# Altium schematic sheet MultiSensor.SchDoc
size 420 x 297 mm; SheetNumber: 1; SheetTotal: 1
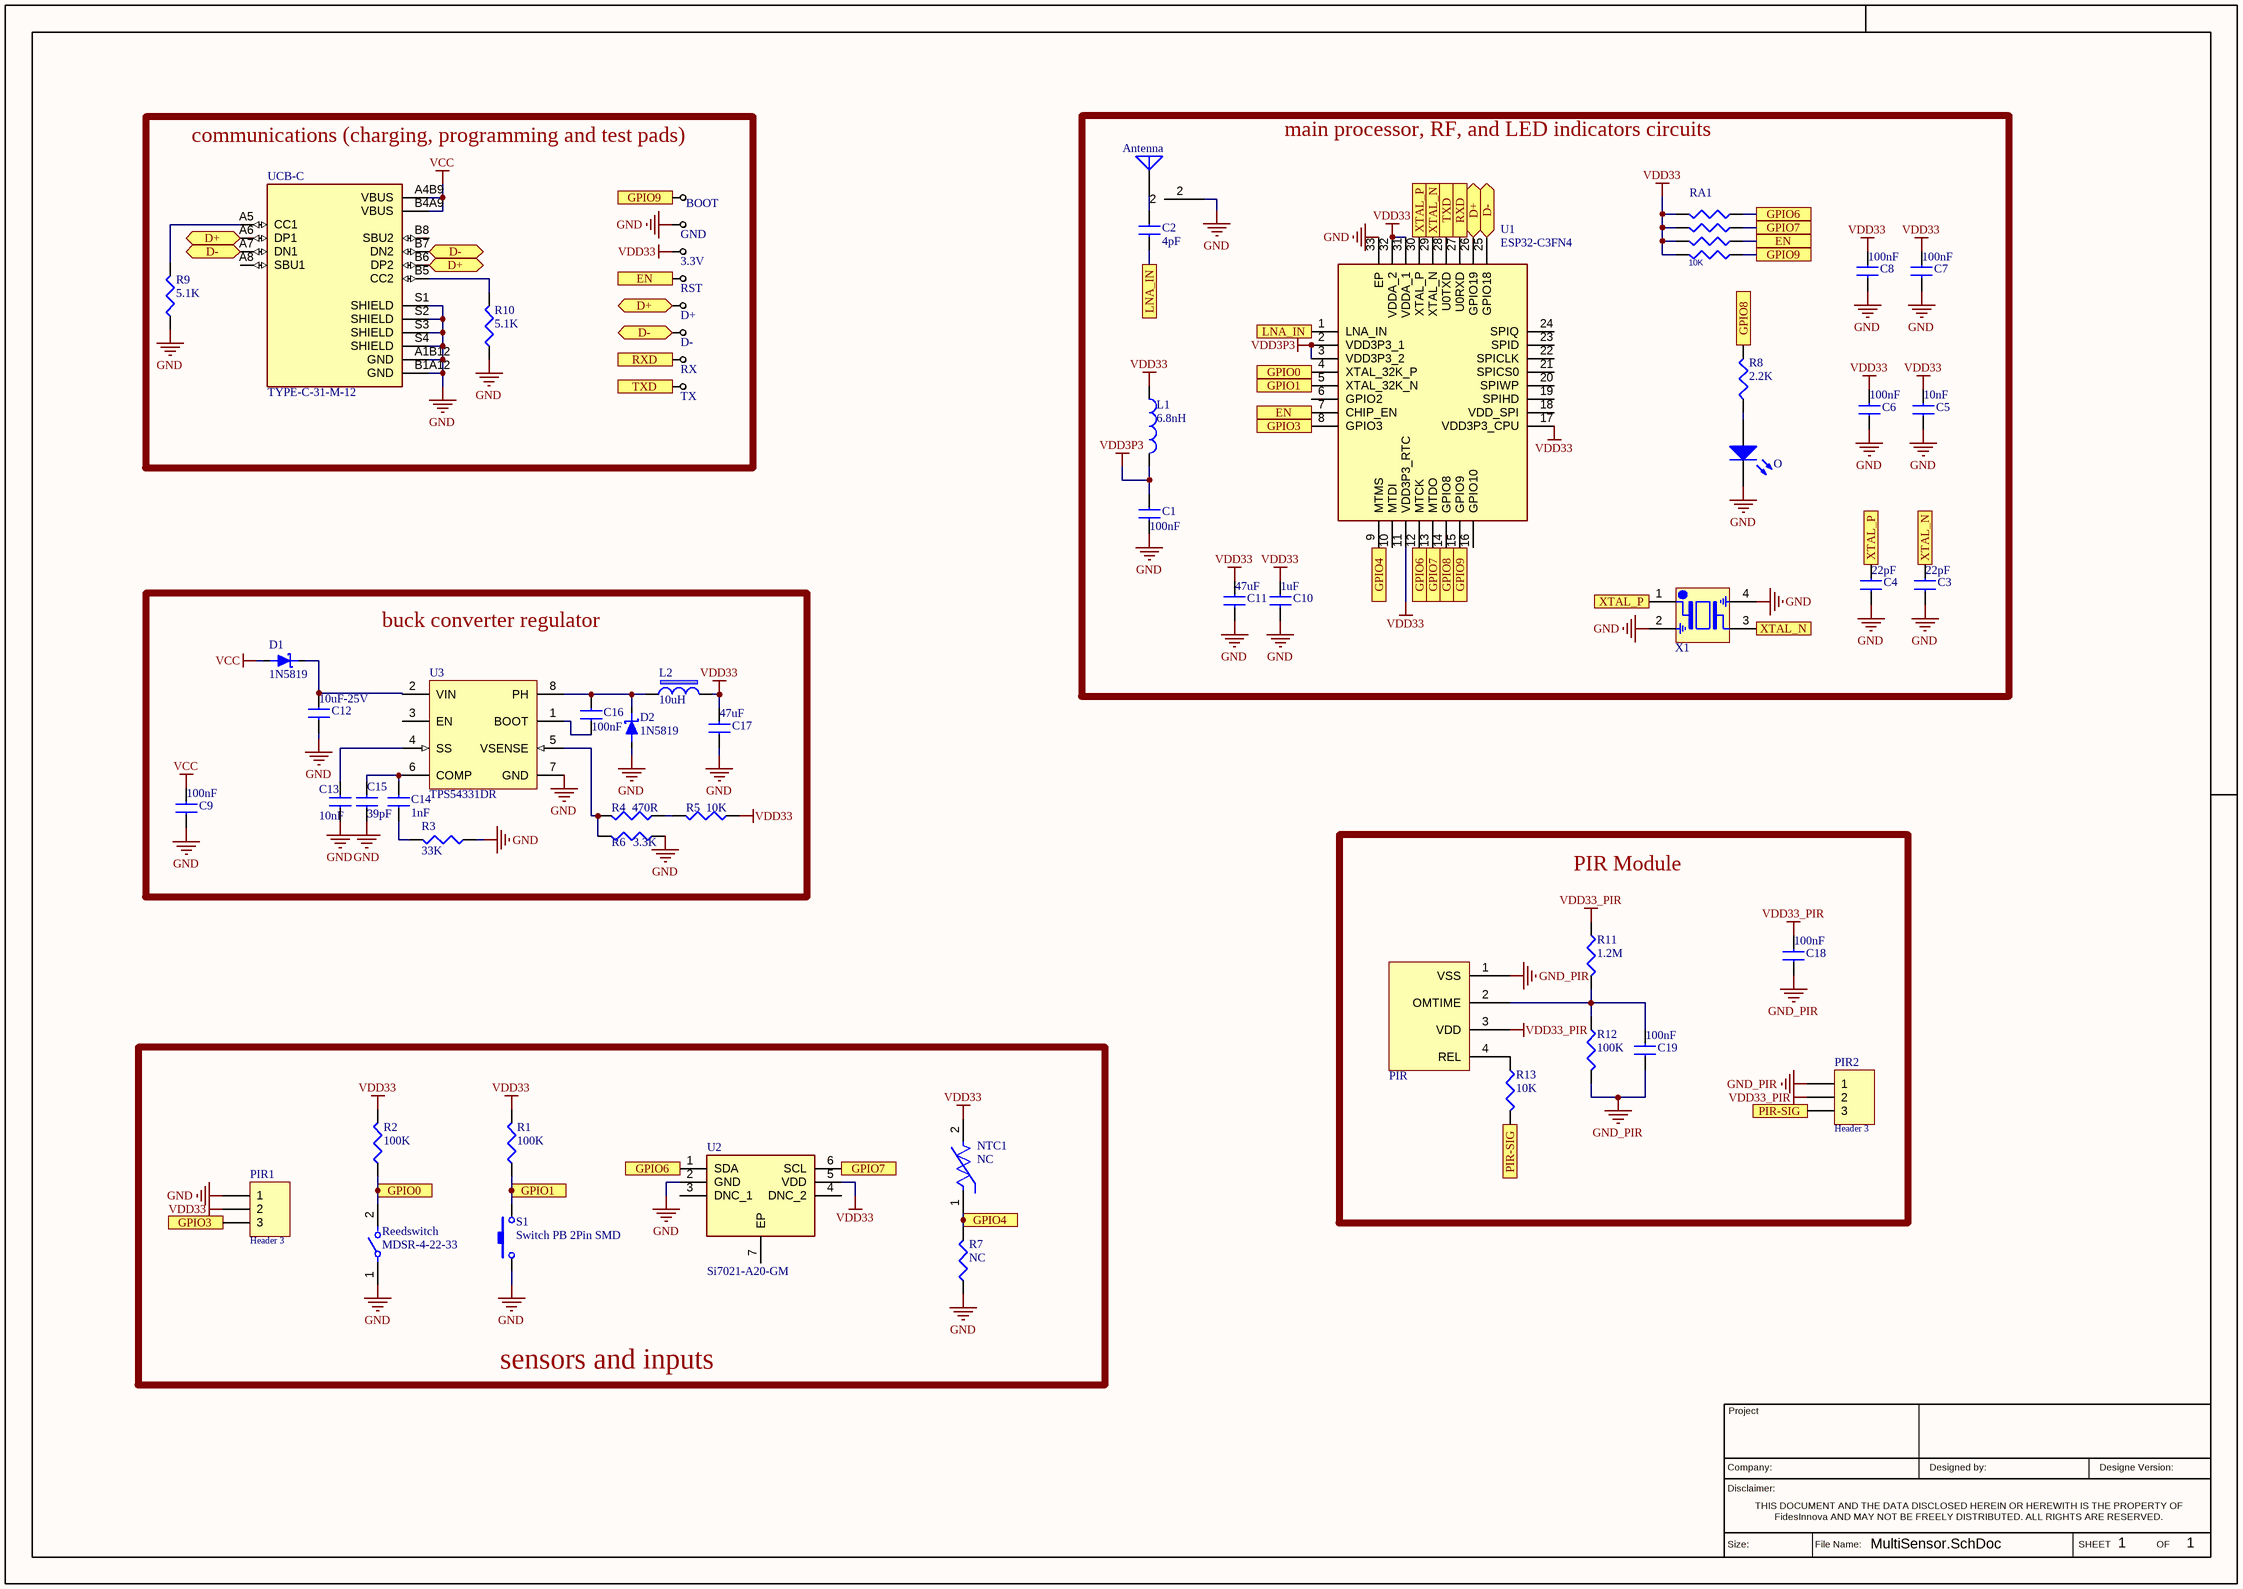
[diagram p0: MultiSensor.SchDoc]

## Parts
3.3V  Test Point  [Test Point SMD]  (value not drawn)  (no BOM)
Antenna  Antenna  [Antenna_IIFA_2.4GHz_ESP]  (value not drawn)  (no BOM)
BOOT  Test Point  [Test Point SMD]  (value not drawn)  (no BOM)
C1  100nF  [0603_C]
C2  4pF  [0603_C]
C3  22pF  [0603_C]
C4  22pF  [0603_C]
C5  10nF  [0603_C]
C6  100nF  [0603_C]
C7  100nF  [0603_C]
C8  100nF  [0603_C]
C9  100nF  [0603_C]
C10  1uF  [0603_C]
C11  47uF  [1206_C]
C12  10uF-25V  [1206_C]
C13  10nF  [0603_C]
C14  1nF  [0603_C]
C15  39pF  [0603_C]
C16  100nF  [0603_C]
C17  47uF  [1206_C]
C18  100nF  [0603_C]
C19  100nF  [0603_C]
D1  1N5819  [DO-214AC]
D2  1N5819  [DO-214AC]
D+  Test Point  [Test Point SMD]  (value not drawn)  (no BOM)
D-  Test Point  [Test Point SMD]  (value not drawn)  (no BOM)
GND  Test Point  [Test Point SMD]  (value not drawn)  (no BOM)
L1  6.8nH  [0603_L]
L2  10uH  [Inductor SMD 3x3.2mm]
NTC1  NC  [FP-NXR_151B020-MFG]  (no BOM)
O  LED  [LED-3mm(RED)]  (value not drawn)
PIR  HM412-PIR  [HM412-PIR]  (value not drawn)
PIR1  Header 3  [HDR_THT_3M_2mm]  (no BOM)
PIR2  Header 3  [HDR_THT_3M_2mm]
R1  100K  [0603_R]
R2  100K  [0603_R]
R3  33K  [0603_R]
R4  470R  [0603_R]
R5  10K  [0603_R]
R6  3.3K  [0603_R]
R7  NC  [0603_R]
R8  2.2K  [0603_R]
R9  5.1K  [0603_R]
R10  5.1K  [0603_R]
R11  1.2M  [0603_R]
R12  100K  [0603_R]
R13  10K  [0603_R]
RA1  10K  [RN8-A]
Reedswitch  MDSR-4-22-33  [FP-MDSR-4-MFG]
RST  Test Point  [Test Point SMD]  (value not drawn)  (no BOM)
RX  Test Point  [Test Point SMD]  (value not drawn)  (no BOM)
S1  Switch PB 2Pin SMD  [SW_PB_SMD_2PIN_SPST_6X3X2]
TX  Test Point  [Test Point SMD]  (value not drawn)  (no BOM)
U1  ESP32-C3FN4  [QFN50P500X500X90-33N-D]
U2  Si7021-A20-GM  [SON100P300X300X80-7N-D]
U3  TPS54331DR  [D0008A_L]
UCB-C  TYPE-C-31-M-12  [TYPE-C-31-M-12]
X1  MJ-40.000-20P-10/30/-40+85  [XNCLH40M000CHJA4P0]  (value not drawn)

## Blocks framed on the sheet
communications (charging, programming and test pads): 3.3V BOOT D+ D- GND R9 R10 RST RX TX UCB-C
main processor, RF, and LED indicators circuits: Antenna C1-C8 C10 C11 L1 O R8 RA1 U1 X1
buck converter regulator: C9 C12-C17 D1 D2 L2 R3-R6 U3
PIR Module: C18 C19 PIR PIR2 R11-R13
sensors and inputs: NTC1 PIR1 R1 R2 R7 Reedswitch S1 U2

## Ports
D+ (bidir, see MultiSensor[1A], MultiSensor[2A]), D+ (bidir, see MultiSensor[1A], MultiSensor[2A], MultiSensor[4A]), D+ (bidir, see MultiSensor[2A], MultiSensor[4A]), D- (bidir, see MultiSensor[1A], MultiSensor[2A]), D- (bidir, see MultiSensor[1A], MultiSensor[2A], MultiSensor[4A]), D- (bidir, see MultiSensor[2A], MultiSensor[4A]), EN (see MultiSensor[2A], MultiSensor[4B]), EN (see MultiSensor[2A], MultiSensor[5A]), EN (see MultiSensor[4B], MultiSensor[5A]), GPIO0 (see MultiSensor[2D]), GPIO0 (see MultiSensor[4A]), GPIO1 (see MultiSensor[2D]), GPIO1 (see MultiSensor[4A]), GPIO3 (see MultiSensor[1D]), GPIO3 (see MultiSensor[4B]), GPIO4 (see MultiSensor[3D]), GPIO4 (see MultiSensor[4B]), GPIO6 (see MultiSensor[2C], MultiSensor[4B]), GPIO6 (see MultiSensor[2C], MultiSensor[5A]), GPIO6 (see MultiSensor[4B], MultiSensor[5A]), GPIO7 (see MultiSensor[3C], MultiSensor[4B]), GPIO7 (see MultiSensor[3C], MultiSensor[5A]), GPIO7 (see MultiSensor[4B], MultiSensor[5A]), GPIO8 (see MultiSensor[4B]), GPIO8 (see MultiSensor[5A]), GPIO9 (see MultiSensor[2A], MultiSensor[4B]), GPIO9 (see MultiSensor[2A], MultiSensor[5A]), GPIO9 (see MultiSensor[4B], MultiSensor[5A]), LNA_IN (see MultiSensor[4A]), PIR-SIG (see MultiSensor[5C]), RXD (see MultiSensor[2A]), RXD (see MultiSensor[4A]), TXD (see MultiSensor[2A]), TXD (see MultiSensor[4A]), XTAL_N (see MultiSensor[4A], MultiSensor[5B]), XTAL_N (see MultiSensor[4A], MultiSensor[6B]), XTAL_N (see MultiSensor[5B], MultiSensor[6B]), XTAL_P (see MultiSensor[4A], MultiSensor[5B]), XTAL_P (see MultiSensor[4A], MultiSensor[6B]), XTAL_P (see MultiSensor[5B], MultiSensor[6B])

## Nets
GND: Antenna.2 C1.2(C2) C3.1(C1) C4.1(C1) C5.1(C1) C6.1(C1) C7.1(C1) C8.1(C1) C9.1(C1) C10.1(C1) C11.1(C1) C12.1(C1) C13.2(C2) C15.2(C2) C17.1(C1) D2.1(A) GND.1(T) O.2(K) PIR1.1 R3.1(R1) R6.1(R1) R7.1(R1) R9.1(R1) R10.1(R1) Reedswitch.1 S1.1 U1.33(EP) U2.2(GND) U3.7(GND) UCB-C.A1B12(GND) UCB-C.B1A12(GND) UCB-C.S1(SHIELD) UCB-C.S2(SHIELD) UCB-C.S3(SHIELD) UCB-C.S4(SHIELD) X1.2(GND) X1.4(GND)
GND_PIR: C18.1(C1) C19.1(C1) PIR.1(VSS) PIR2.1 R12.2(R2)
VCC: C9.2(C2) D1.1(A) UCB-C.A4B9(VBUS) UCB-C.B4A9(VBUS)
VDD3P3: C1.1(C1) L1.2 U1.2(VDD3P3_1) U1.3(VDD3P3_2)
VDD33: 3.3V.1(T) C5.2(C2) C6.2(C2) C7.2(C2) C8.2(C2) C10.2(C2) C11.2(C2) C17.2(C2) L1.1 L2.1 NTC1.2 PIR1.2 R1.2(R2) R2.2(R2) R5.1(R1) RA1.5(R4) RA1.6(R3) RA1.7(R2) RA1.8(R1) U1.11(VDD3P3_RTC) U1.17(VDD3P3_CPU) U1.31(VDDA_1) U1.32(VDDA_2) U2.5(VDD)
VDD33_PIR: C18.2(C2) PIR.3(VDD) PIR2.2 R11.1(R1)
D+: D+.1(T) U1.26(GPIO19) UCB-C.A6(DP1) UCB-C.B6(DP2) ; port D+
D-: D-.1(T) U1.25(GPIO18) UCB-C.A7(DN1) UCB-C.B7(DN2) ; port D-
EN: RA1.2(R2) RST.1(T) U1.7(CHIP_EN) ; port EN
GPIO0: R2.1(R1) Reedswitch.2 U1.4(XTAL_32K_P) ; port GPIO0
GPIO1: R1.1(R1) S1.2 U1.5(XTAL_32K_N) ; port GPIO1
GPIO3: PIR1.3 U1.8(GPIO3) ; port GPIO3
GPIO4: NTC1.1 R7.2(R2) U1.9(MTMS) ; port GPIO4
GPIO6: RA1.4(R4) U1.12(MTCK) U2.1(SDA) ; port GPIO6
GPIO7: RA1.3(R3) U1.13(MTDO) U2.6(SCL) ; port GPIO7
GPIO8: R8.2(R2) U1.14(GPIO8) ; port GPIO8
GPIO9: BOOT.1(T) RA1.1(R1) U1.15(GPIO9) ; port GPIO9
LNA_IN: C2.1(C1) U1.1(LNA_IN) ; port LNA_IN
PIR-SIG: PIR2.3 R13.2(R2) ; port PIR-SIG
RXD: RX.1(T) U1.27(U0RXD) ; port RXD
TXD: TX.1(T) U1.28(U0TXD) ; port TXD
XTAL_N: C3.2(C2) U1.29(XTAL_N) X1.3(IN/OUT) ; port XTAL_N
XTAL_P: C4.2(C2) U1.30(XTAL_P) X1.1(IN/OUT) ; port XTAL_P
NetAntenna_1: Antenna.1(A) C2.2(C2)
NetC12_2: C12.2(C2) D1.2(K) U3.2(VIN)
NetC13_1: C13.1(C1) U3.4(SS)
NetC14_1: C14.1(C1) C15.1(C1) U3.6(COMP)
NetC14_2: C14.2(C2) R3.2(R2)
NetC16_1: C16.1(C1) U3.1(BOOT)
NetC16_2: C16.2(C2) D2.2(K) L2.2 U3.8(PH)
NetC19_2: C19.2(C2) PIR.2(OMTIME) R11.2(R2) R12.1(R1)
NetO_1: O.1(A) R8.1(R1)
NetPIR_4: PIR.4(REL) R13.1(R1)
NetR4_1: R4.1(R1) R5.2(R2)
NetR4_2: R4.2(R2) R6.2(R2) U3.5(VSENSE)
NetR9_2: R9.2(R2) UCB-C.A5(CC1)
NetR10_2: R10.2(R2) UCB-C.B5(CC2)

Not connected (* = marked no-connect by the designer): U1 6(GPIO2) 10(MTDI) 16(GPIO10) 18(VDD_SPI) 19(SPIHD) 20(SPIWP) 21(SPICS0) 22(SPICLK) 23(SPID) 24(SPIQ); U2 3(DNC_1) 4(DNC_2) 7(EP); U3 3(EN); UCB-C A8(SBU1) B8(SBU2)

## Notes on the sheet
- Company:
- Project
- Designed by:
- Designe Version:
- Size:
- Disclaimer:
- THIS DOCUMENT AND THE DATA DISCLOSED HEREIN OR HEREWITH IS THE PROPERTY OF FidesInnova AND MAY NOT BE FREELY DISTRIBUTED. ALL RIGHTS ARE RESERVED.
- File Name:
- SHEET
- OF

## Library data of the parts
Antenna = Antenna: Generic Antenna
C1-C10 C13 C16 C18 C19 = Capacitor Ceramic SMD: Ceramic Multilayer SMD Capacitor; Rating: [50V]; Tolerance: [5%]; Operating Temp: -55 TO 125 °C; Storage Temp: -55 TO 125 °C
  C1 C6-C9 C16 C18 C19: Value: 100nF
  C2: Value: 4pF
  C3 C4: Value: 22pF
  C5 C13: Value: 10nF
  C10: Value: 1uF
C11 C12 C17 = Capacitor Ceramic SMD: Ceramic Multilayer SMD Capacitor; Rating: [50V]; Tolerance: [5%]; Value: 22uF; Operating Temp: -55 TO 125 °C; Storage Temp: -55 TO 125 °C
C14 = Capacitor Ceramic SMD: Ceramic Multilayer SMD Capacitor; Rating: [50V]; Tolerance: [5%]; Value: 100nF; Operating Temp: -55 TO 125 °C; Storage Temp: -55 TO 125 °C
C15 = Capacitor Ceramic SMD: Ceramic Multilayer SMD Capacitor; Rating: [50V]; Tolerance: [5%]; Value: 10nF; Operating Temp: -55 TO 125 °C; Storage Temp: -55 TO 125 °C
D1 D2 = 1N5819: 1N5819 Schottky diode
L1 = Inductor: General Porpose Inductor; Manufacturer: Murata; Rating: 850mA; Tolerance: ±0.1nH; Link to Datasheet: *; Link to Picture: *; Operating Temp: -55°C ~ +150°C; Stability Frequency: *; Storage Temp: -55°C ~ +150°C; ComponentLink1Description: *; ComponentLink1URL: *; Value: 6.8nH
L2 = Inductor_B: Inductor; Code_IEC: 1005; Published: 8-Jun-2000; LatestRevisionDate: 17-Jul-2002; LatestRevisionNote: Re-released for DXP Platform.; PackageReference: 0402-A; Publisher: Altium Limited; Code_JEITA: 0402
NTC1 = CMP-06022-000921-1: Thermistor NTC 10kΩ ±1% 2-Pin Radial Bulk; Resistance: 10kR; Power Rating: 7.5mW; Lead Diameter: 0.4mm; Case/Package: 0402; Min Operating Temperature: -40°C; Radiation Hardening: No; Max Operating Temperature: 125°C; Mount: Through Hole; Termination: Radial; Width: 4mm; Number of Pins: 2; Lead Pitch: 2.5mm; Length: 5mm; Tolerance: 1%; Packaging: Bulk; Height: 2mm; Package Quantity: 500; Max Power Dissipation: 7.5mW
O = LED: Light Emitting Diode; Manufacturer: ---; Rating: 40mA; Operating Temp: -30°C to +100°C; Storage Temp: -55°C to +125°C; Value: LED
PIR = PIR
PIR1 PIR2 = Header 3: Header, single row, 3 pin
R1 R2 R4-R6 R8 R11-R13 = Resistor SMD: SMD Resistor; Voltage Rating: [1KV]; Rating: 0.1 W; Tolerance: [1%]; Operating Temp: -55 to 155 °C; Storage Temp: -55 to 155 °C; ComponentLink1Description: *; ComponentLink1URL: *
  R1 R2 R12: Value: 100K
  R4: Value: 470R
  R5 R13: Value: 10K
  R6: Value: 3.3K
  R8: Value: 2.2K
  R11: Value: 1.2M
R3 = Resistor SMD: SMD Resistor; Voltage Rating: [1KV]; Rating: 0.1 W; Value: 100R; Tolerance: [1%]; Operating Temp: -55 to 155 °C; Storage Temp: -55 to 155 °C; ComponentLink1Description: *; ComponentLink1URL: *
R7 = Resistor SMD: SMD Resistor; Voltage Rating: [1KV]; Rating: 0.1 W; Value: 10K; Tolerance: [1%]; Operating Temp: -55 to 155 °C; Storage Temp: -55 to 155 °C; ComponentLink1Description: *; ComponentLink1URL: *
R9 R10 = Resistor SMD: SMD Resistor; Voltage Rating: [1KV]; Rating: 0.1 W; Value: 100K; Tolerance: [1%]; Operating Temp: -55 to 155 °C; Storage Temp: -55 to 155 °C; ComponentLink1Description: *; ComponentLink1URL: *
RA1 = Resistor Array SMD: SMD Resistor Arrays; Voltage Rating: [1KV]; Tolerance: [5%]; Rating: 0.1 W; Operating Temp: -55 to 155 °C; Storage Temp: -55 to 155 °C; ComponentLink1Description: *; ComponentLink1URL: *; Value: 10K
Reedswitch = CMP-08625-000002-1: SWITCH REED SPST-NO 500MA 200V; Release Time: 0.2ms; Throw Configuration: SPST; Operate Time: 0.6ms; Power Rating: 10W; Capacitance: 0.2pF; Lead Free: Lead Free; Mount: Through Hole; Series: MDSR-4; Package Quantity: 100; Packaging: Bulk; Voltage Rating (AC): 200V; Min Operating Temperature: -40°C; Termination: Axial; Max Operating Temperature: 125°C
S1 = SW-PB-2Pin-SMD: SMT Tactile ‎Switch
U1 = ESP32-C3FN4: Integrated Circuit; Manufacturer_Name: Espressif Systems; Datasheet Link: https://www.mouser.co.uk/datasheet/2/891/esp32_c3_datasheet_en-1989865.pdf; Height: 0.9mm; Manufacturer_Part_Number: ESP32-C3FN4; Mouser Part Number: 356-ESP32-C3FN4; Mouser Price/Stock: https://www.mouser.co.uk/ProductDetail/Espressif-Systems/ESP32-C3FN4?qs=iLbezkQI%252BsjnhgSmJXMnMQ%3D%3D
U2 = Si7021-A20-GM: Integrated Circuit; Manufacturer_Name: Silicon Labs; Datasheet Link: https://www.silabs.com/documents/public/data-sheets/Si7021-A20.pdf; Height: 0.8mm; Manufacturer_Part_Number: Si7021-A20-GM; Mouser Part Number: 634-SI7021-A20-GM; Mouser Price/Stock: https://www.mouser.co.uk/ProductDetail/Silicon-Labs/SI7021-A20-GM?qs=p9T7GgSe1IF3zthZwYOz5w%3D%3D; Arrow Part Number: SI7021-A20-GM; Arrow Price/Stock: https://www.arrow.com/en/products/si7021-a20-gm/silicon-labs
U3 = CMP-0323-00209-3: Buck Step Down Regulator with 3.5 to 28 V Input and 0.8 to 25 V Output, -40 to 150 degC, 8-Pin SOIC (D), Green (RoHS & no Sb/Br); Manufacturer: Texas Instruments; Vin(Max)(V): 28; Duty Cycle(Max)(%): 90; Vin(Min)(V): 3.5; Iq(Typ)(mA): 0.11; SubFamily: Step-Down Regulator; Rating: Catalog; Iout(Max)(A): 3; Regulated Outputs(#): 1; Vout(Max)(V): 25; Vout(Min)(V): 0.8; Code_JEDEC: MS-012AA; DatasheetVersion: SLVS839D; ComponentLink3Description: URL Link1; Topology: Buck; ComponentLink2URL: http://www.ti.com/litv/pdf/msoi002j; Eco-Plan: Green (RoHS & no Sb/Br); ComponentLink1URL: http://www.ti.com/general/docs/lit/getliterature.tsp?genericPartNumber=TPS54331&fileType=pdf; Mounting Technology: Surface Mount; PartNumber: TPS54331DR; ComponentLink3URL: Samples URL:http://www.ti.com/product/tps54331#samples; ComponentLink1Description: Datasheet; PackageVersion: revM, Jun-2011; ComponentLink2Description: Package Specification; PackageDescription: 8-Pin Plastic Small Outline Integrated Circuit, 4.9 x 3.9 mm, Pitch 1.27 mm Pitch; Switch Current Limit(Typ)(A): 3.5; PackageReference: D0008A
UCB-C = TYPE-C-31-M-12: USB Connectors 24 Receptacle 1 8.94*7.3mm RoHS; Package: None; Availability: Unavailable; Value: *; MP: TYPE-C-31-M-12; Price: None
X1 = SMT_XTAL_PASSIVE: Passive crystal